# EAGLE design qtwo_schem (EAGLE 7.6.0)
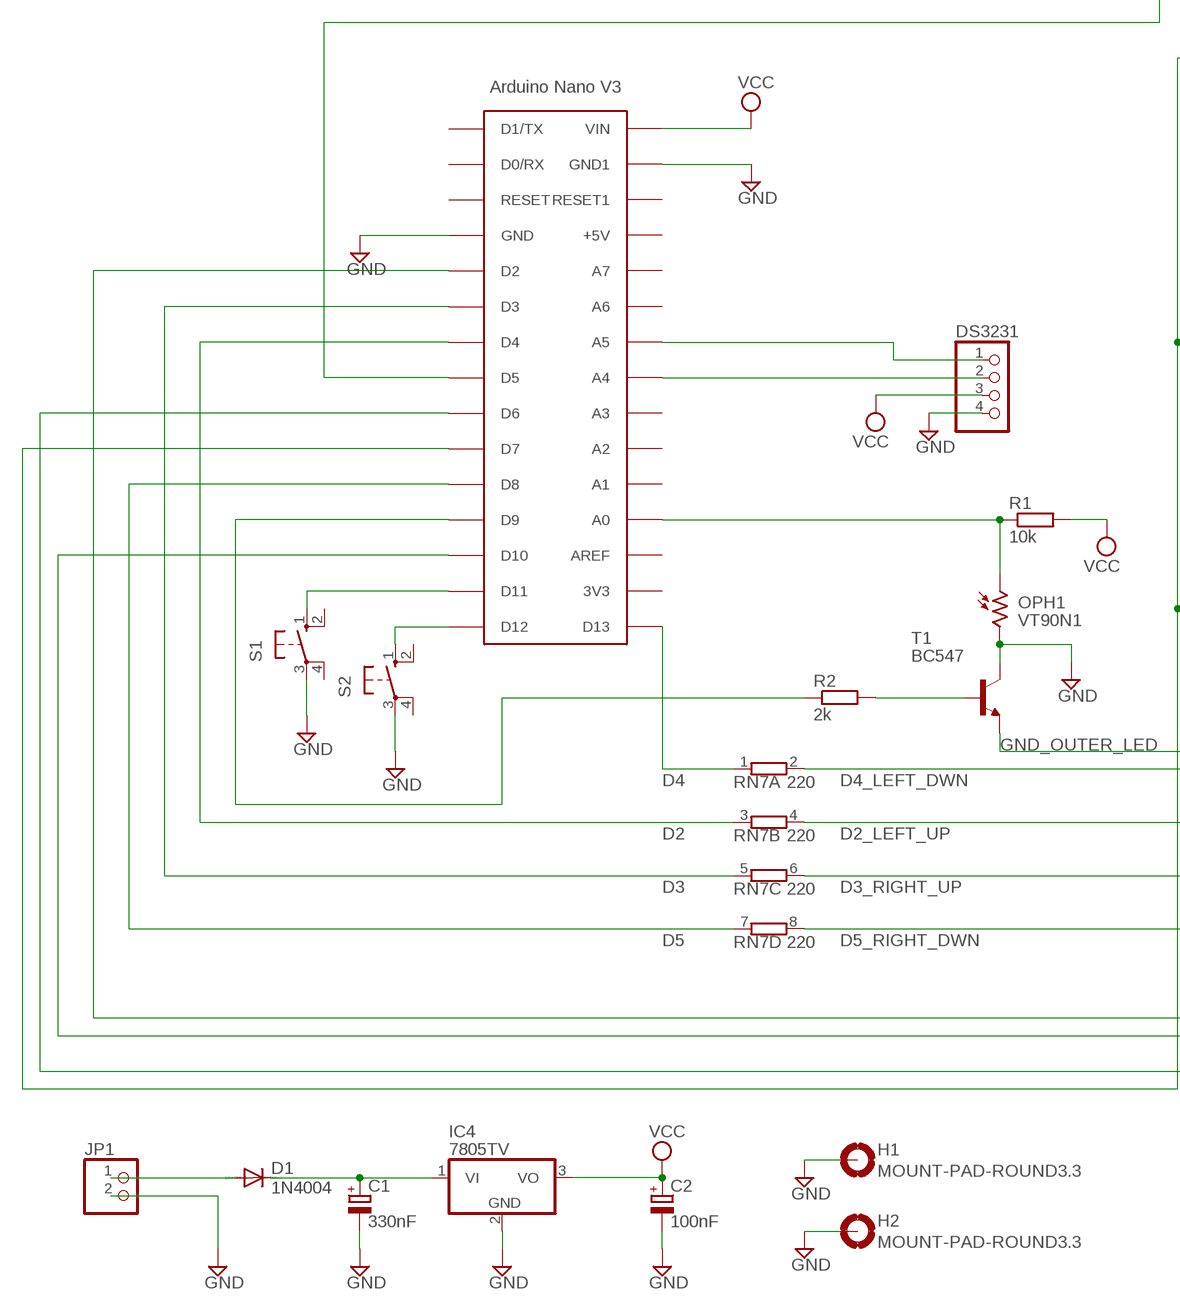
[diagram p0: schematic, sheet 1, part 1 of 2]
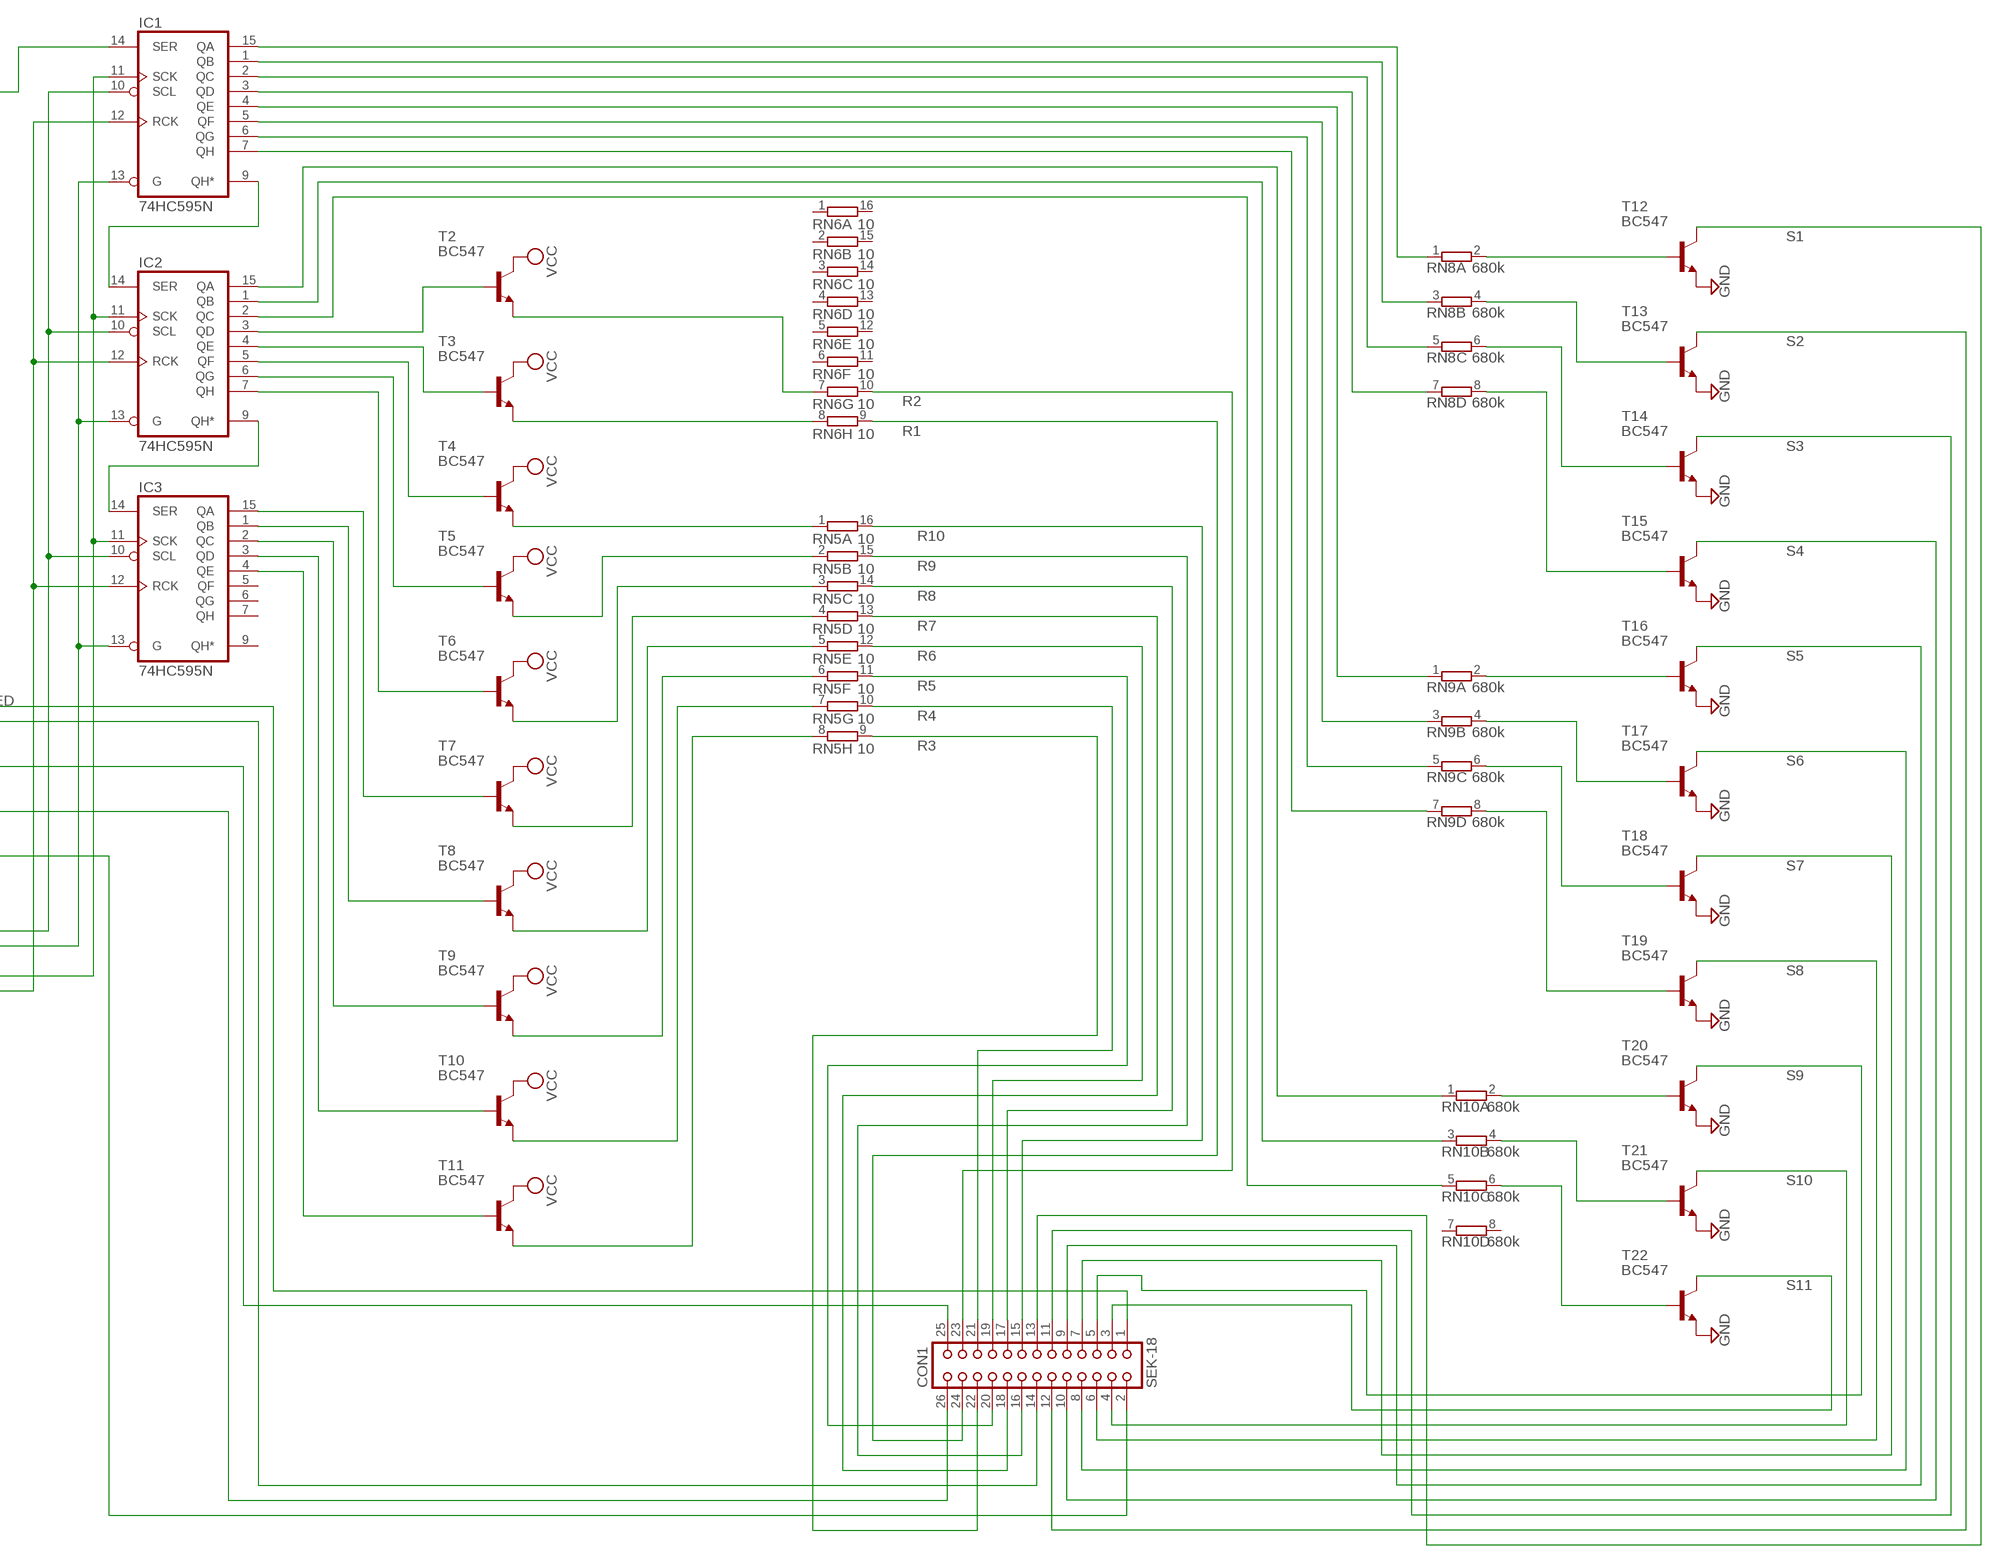
[diagram p1: schematic, sheet 1, part 2 of 2]

## Parts
C1  330nF  CPOL-EUE2,5-6E  [E2,5-6E]
C2  100nF  CPOL-EUE2,5-6E  [E2,5-6E]
CON1  SEK-18  CON26  [CON26]
D1  1N4004  [DO41-10]
DS3231  PINHD-1X4  [1X04]
H1  MOUNT-PAD-ROUND3.3  [3,3-PAD]
H2  MOUNT-PAD-ROUND3.3  [3,3-PAD]
IC1  74HC595N  [DIL16]
IC2  74HC595N  [DIL16]
IC3  74HC595N  [DIL16]
IC4  7805TV  [TO220V]
JP1  PINHD-1X2  [1X02]
OPH1  VT90N1  [VT900]
R1  10k  R-EU_0204/7  [0204/7]
R2  2k  R-EU_0204/7  [0204/7]
RN5  10  8R-N  [DIL16]
RN6  10  8R-N  [DIL16]
RN7  220  E4R  [SIL8]
RN8  680k  E4R  [SIL8]
RN9  680k  E4R  [SIL8]
RN10  680k  E4R  [SIL8]
S1  10-XX  [B3F-10XX]
S2  10-XX  [B3F-10XX]
T1  BC547  [TO92]
T2  BC547  [TO92]
T3  BC547  [TO92]
T4  BC547  [TO92]
T5  BC547  [TO92]
T6  BC547  [TO92]
T7  BC547  [TO92]
T8  BC547  [TO92]
T9  BC547  [TO92]
T10  BC547  [TO92]
T11  BC547  [TO92]
T12  BC547  [TO92]
T13  BC547  [TO92]
T14  BC547  [TO92]
T15  BC547  [TO92]
T16  BC547  [TO92]
T17  BC547  [TO92]
T18  BC547  [TO92]
T19  BC547  [TO92]
T20  BC547  [TO92]
T21  BC547  [TO92]
T22  BC547  [TO92]
U$1  ARDUINONANO  [PDIP-32]

## Nets
D2: RN7.3 U$1.D4
D2_LEFT_UP: CON1.25 RN7.4
D3: RN7.5 U$1.D3
D3_RIGHT_UP: CON1.26 RN7.6
D4: RN7.1 U$1.D13
D4_LEFT_DWN: CON1.14 RN7.2
D5: RN7.7 U$1.D8
D5_RIGHT_DWN: CON1.2 RN7.8
GND: C1.- C2.- DS3231.4 H1.B3,3(MOUNT) H2.B3,3(MOUNT) IC4.2(GND) JP1.2 OPH1.2 S1.3(P) S2.3(P) T1.3(C) T12.1(E) T13.1(E) T14.1(E) T15.1(E) T16.1(E) T17.1(E) T18.1(E) T19.1(E) T20.1(E) T21.1(E) T22.1(E) U$1.GND U$1.GND1
GND_OUTER_LED: CON1.1 T1.1(E)
N$1: C1.+ D1.C IC4.1(VI)
N$2: D1.A JP1.1
N$3: DS3231.2 U$1.A3(A4)
N$4: DS3231.1 U$1.A2(A5)
N$5: OPH1.1 R1.1 U$1.A7(A0)
N$6: S1.1(S) U$1.D11
N$7: S2.1(S) U$1.D12
N$8: IC1.10(SCL) IC2.10(SCL) IC3.10(SCL) U$1.D2
N$9: R2.1 U$1.D9
N$10: R2.2 T1.2(B)
N$11: IC1.13(G) IC2.13(G) IC3.13(G) U$1.D10
N$12: IC1.11(SCK) IC2.11(SCK) IC3.11(SCK) U$1.D6
N$13: IC1.12(RCK) IC2.12(RCK) IC3.12(RCK) U$1.D7
N$14: IC1.14(SER) U$1.D5
N$15: IC1.9(QH*) IC2.14(SER)
N$16: IC2.9(QH*) IC3.14(SER)
N$17: IC2.3(QD) T2.2(B)
N$18: IC2.4(QE) T3.2(B)
N$19: IC2.5(QF) T4.2(B)
N$20: IC2.6(QG) T5.2(B)
N$21: IC2.7(QH) T6.2(B)
N$22: IC3.15(QA) T7.2(B)
N$23: IC3.1(QB) T8.2(B)
N$24: IC3.2(QC) T9.2(B)
N$25: IC3.3(QD) T10.2(B)
N$26: IC3.4(QE) T11.2(B)
N$27: RN8.2 T12.2(B)
N$28: RN8.4 T13.2(B)
N$29: RN8.6 T14.2(B)
N$30: RN8.8 T15.2(B)
N$31: RN9.2 T16.2(B)
N$32: RN9.4 T17.2(B)
N$33: RN9.6 T18.2(B)
N$34: RN9.8 T19.2(B)
N$35: RN10.2 T20.2(B)
N$36: RN10.4 T21.2(B)
N$37: RN10.6 T22.2(B)
N$38: IC1.15(QA) RN8.1
N$39: IC1.1(QB) RN8.3
N$40: IC1.2(QC) RN8.5
N$41: IC1.3(QD) RN8.7
N$42: IC1.4(QE) RN9.1
N$43: IC1.5(QF) RN9.3
N$44: IC1.6(QG) RN9.5
N$45: IC1.7(QH) RN9.7
N$46: IC2.15(QA) RN10.1
N$47: IC2.1(QB) RN10.3
N$48: IC2.2(QC) RN10.5
N$49: RN6.7 T2.1(E)
N$50: RN6.8 T3.1(E)
N$51: RN5.1 T4.1(E)
N$52: RN5.2 T5.1(E)
N$53: RN5.3 T6.1(E)
N$54: RN5.4 T7.1(E)
N$55: RN5.5 T8.1(E)
N$56: RN5.6 T9.1(E)
N$57: RN5.7 T10.1(E)
N$58: RN5.8 T11.1(E)
R1: CON1.24 RN6.9
R2: CON1.23 RN6.10
R3: CON1.22 RN5.9
R4: CON1.21 RN5.10
R5: CON1.20 RN5.11
R6: CON1.19 RN5.12
R7: CON1.18 RN5.13
R8: CON1.17 RN5.14
R9: CON1.16 RN5.15
R10: CON1.15 RN5.16
S1: CON1.13 T12.3(C)
S2: CON1.12 T13.3(C)
S3: CON1.11 T14.3(C)
S4: CON1.10 T15.3(C)
S5: CON1.9 T16.3(C)
S6: CON1.8 T17.3(C)
S7: CON1.7 T18.3(C)
S8: CON1.6 T19.3(C)
S9: CON1.5 T20.3(C)
S10: CON1.4 T21.3(C)
S11: CON1.3 T22.3(C)
VCC: C2.+ DS3231.3 IC4.3(VO) R1.2 T2.3(C) T3.3(C) T4.3(C) T5.3(C) T6.3(C) T7.3(C) T8.3(C) T9.3(C) T10.3(C) T11.3(C) U$1.VIN
Unconnected: IC3.5(QF) IC3.6(QG) IC3.7(QH) IC3.9(QH*) RN6.1 RN6.2 RN6.3 RN6.4 RN6.5 RN6.6 RN6.11 RN6.12 RN6.13 RN6.14 RN6.15 RN6.16 RN10.7 RN10.8 S1.2(S1) S1.4(P1) S2.2(S1) S2.4(P1) U$1.3V3 U$1.+5V U$1.A0(A7) U$1.A1(A6) U$1.A4(A3) U$1.A5(A2) U$1.A6(A1) U$1.AREF U$1.D0/RX U$1.D1/TX U$1.RESET U$1.RESET1

## Power pins joined to a net without a drawn wire
GND: IC1.8(GND) IC2.8(GND) IC3.8(GND)
VCC: IC1.16(VCC) IC2.16(VCC) IC3.16(VCC)

## Library data of the parts
C1 C2 = rcl:CPOL-EU: POLARIZED CAPACITOR, European symbol
CON1 = con-harting:CON26: CONNECTOR; OC_FARNELL: unknown; OC_NEWARK: unknown
D1 = diode:1N4004: DIODE general purpose rectifier, 1 A
DS3231 = pinhead:PINHD-1X4: PIN HEADER
H1 H2 = holes:MOUNT-PAD-ROUND: MOUNTING PAD, round
IC1-IC3 = 74xx-eu:74*595: 8-bit SHIFT REGISTER, output latch
IC4 = linear:78*: Positive VOLTAGE REGULATOR Source: http://cache.national.com/ds/LM/LM78L05.pdf http://www.fairchildsemi.com/ds/LM/LM7805.pdf
JP1 = pinhead:PINHD-1X2: PIN HEADER
OPH1 = photo-elements:VT9: Photoconductive Cell VT900 Series Source: http://optoelectronics.perkinelmer.com/content/Datasheets/DTS_vt900seriesdatasheet.pdf
R1 R2 = rcl:R-EU_: RESISTOR, European symbol
RN5 RN6 = resistor-dil:8R-N: DIL RESISTOR; OC_FARNELL: unknown; OC_NEWARK: unknown
RN7-RN10 = resistor-sil:E4R: SIL RESISTOR; OC_FARNELL: unknown; OC_NEWARK: unknown
S1 S2 = switch-omron:10-XX: OMRON SWITCH; MPN: B3F-1000; OC_FARNELL: 176432; OC_NEWARK: 36M3542
T1-T22 = transistor:BC547: NPN TRANSISTOR
U$1 = CRE-Lib1:ARDUINONANO: Arduino Nano

## Board
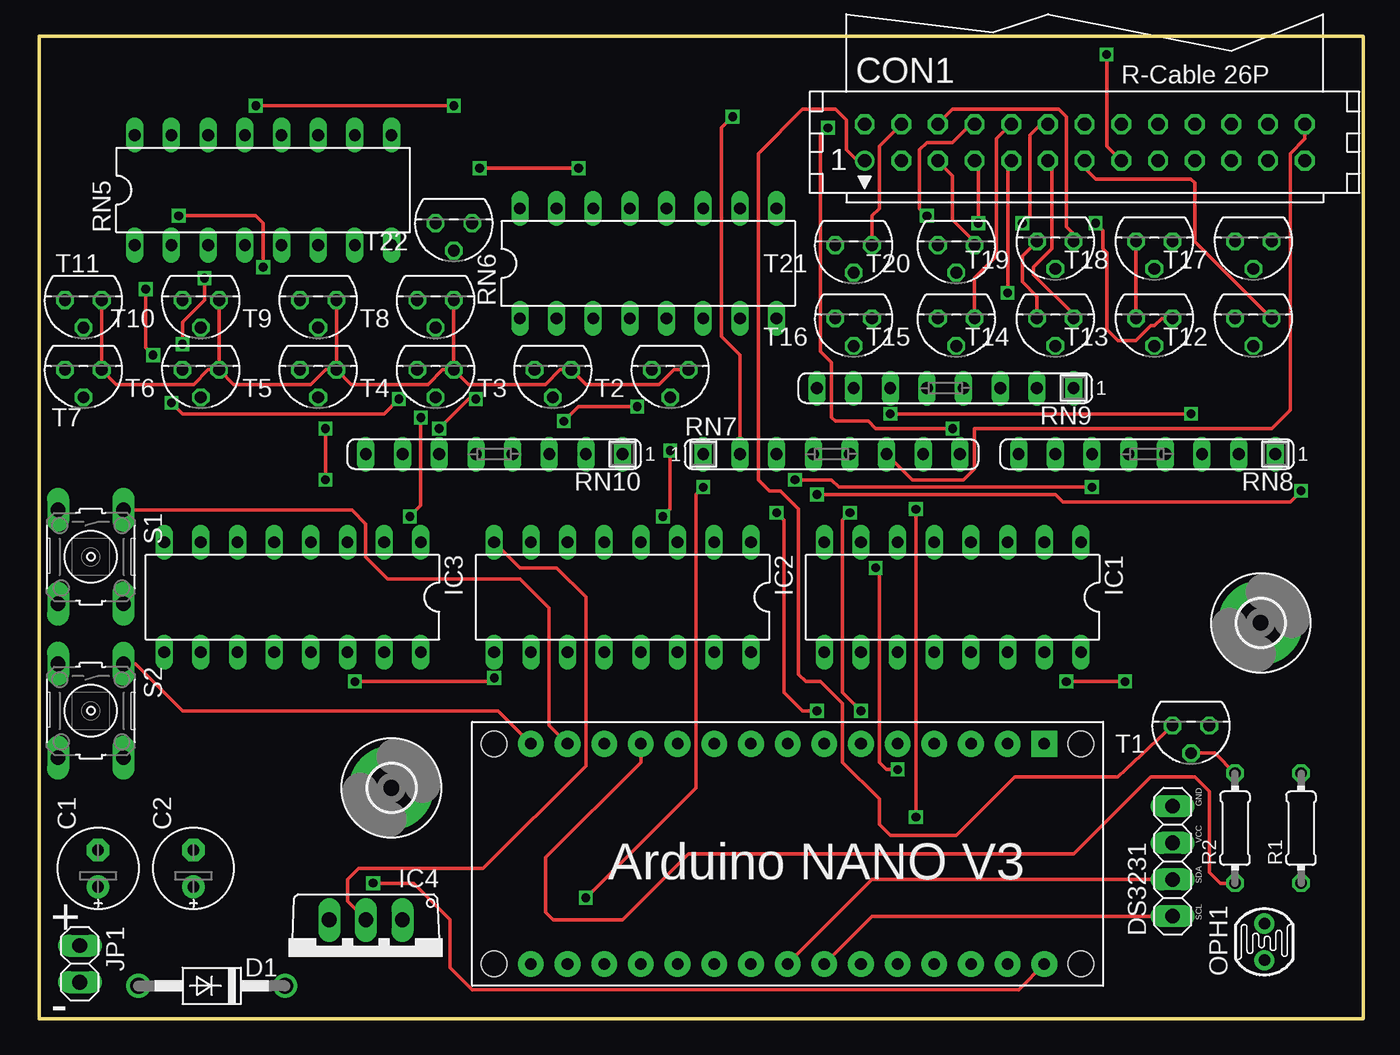
[diagram p2: board, top side]
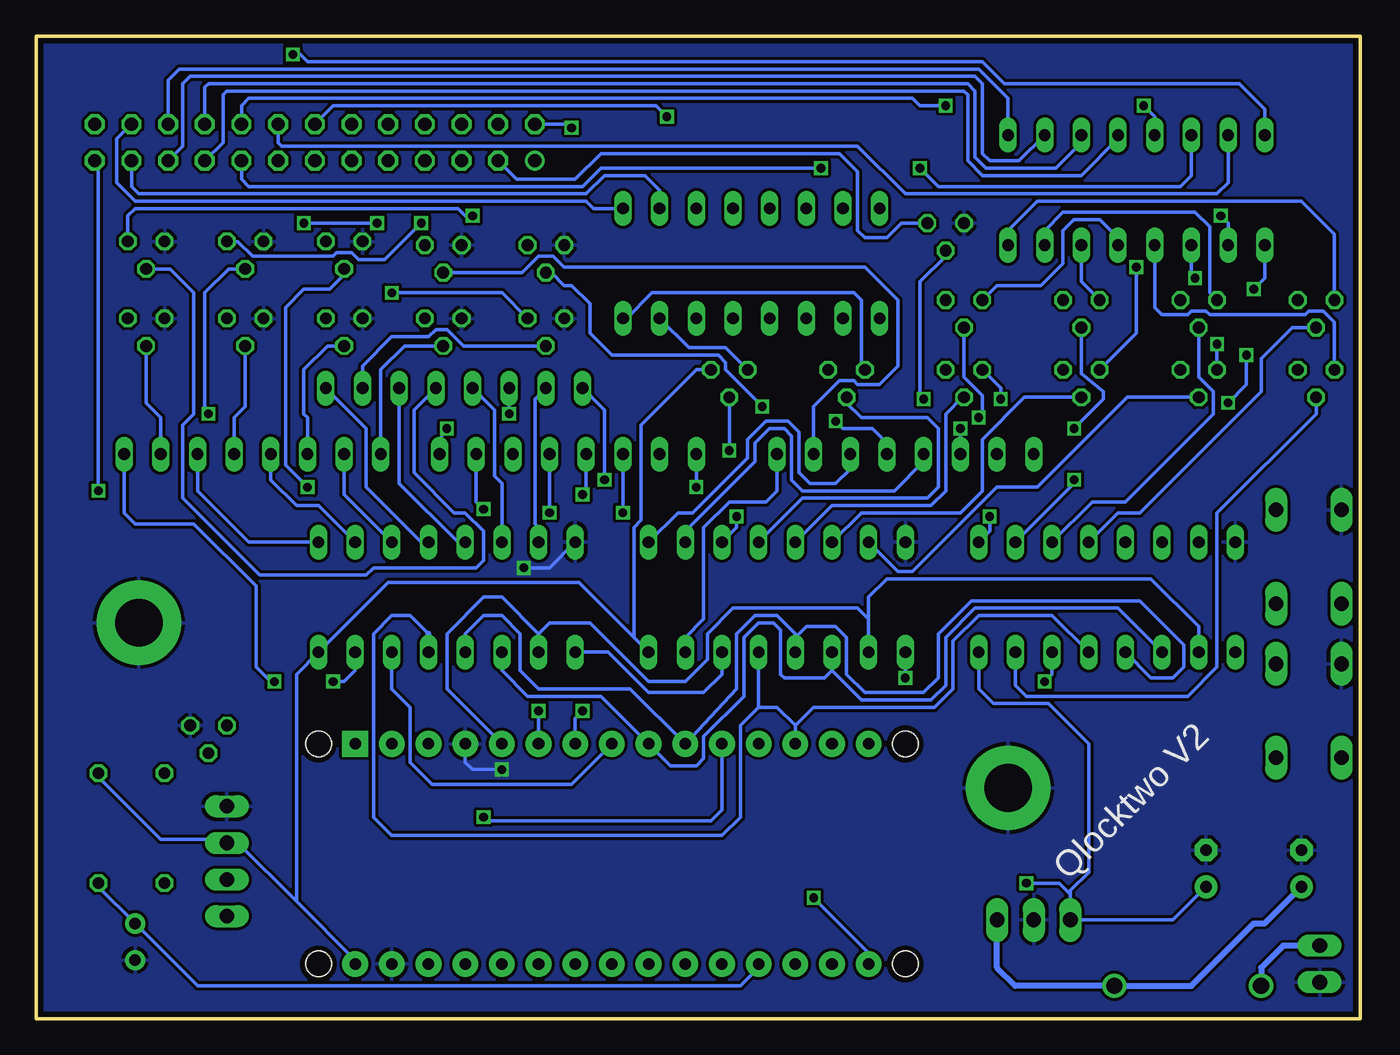
[diagram p3: board, bottom side, seen from below]

Size 91.69 x 68.07 mm. Coordinates in mm from the lower left corner, seen from the top.
Outline: 0,0 91.69,0 91.69,68.07 0,68.07 0,0
Copper layers (1*16): Top 0.0356mm / dielectric 1.5011mm / Bottom 0.0356mm
Design rules "oshpark-2layer": minimum track width 8mil, minimum drill 13mil, track to track 8mil, track to pad 8mil, pad to pad 8mil, via to via 8mil, smd to smd 8mil, copper to edge 15mil, drill to drill 8mil, minimum pad ring 7mil, minimum via ring 7mil, stop-mask expansion 2.5mil, vias tented up to drill 0mil, thermal gap 10mil

### Footprints (pad centres in the part's own frame; a part is rotated, then mirrored left to right if it is on the bottom)
E2,5-6E = drill 0.813 pad 1.575: + -1.27,0 | drill 0.813 pad 1.575 octagon: - 1.27,0
CON26 = drill 0.914: 1 -15.24,-1.27 | drill 0.914 octagon: 2 -15.24,1.27; 3 -12.7,-1.27; 4 -12.7,1.27; 5 -10.16,-1.27; 6 -10.16,1.27; 7 -7.62,-1.27; 8 -7.62,1.27; 9 -5.08,-1.27; 10 -5.08,1.27; 11 -2.54,-1.27; 12 -2.54,1.27; 13 0,-1.27; 14 0,1.27; 15 2.54,-1.27; 16 2.54,1.27; 17 5.08,-1.27; 18 5.08,1.27; 19 7.62,-1.27; 20 7.62,1.27; 21 10.16,-1.27; 22 10.16,1.27; 23 12.7,-1.27; 24 12.7,1.27; 25 15.24,-1.27; 26 15.24,1.27
DO41-10 = drill 1.118: A 5.08,0; C -5.08,0
1X04 = drill 1.016 long: 1 -3.81,0; 2 -1.27,0; 3 1.27,0; 4 3.81,0
3,3-PAD = drill 3.3 pad 5.842: B3,3 0,0
DIL16 = drill 0.813 long: 1 -8.89,-3.81; 2 -6.35,-3.81; 3 -3.81,-3.81; 4 -1.27,-3.81; 5 1.27,-3.81; 6 3.81,-3.81; 7 6.35,-3.81; 8 8.89,-3.81; 9 8.89,3.81; 10 6.35,3.81; 11 3.81,3.81; 12 1.27,3.81; 13 -1.27,3.81; 14 -3.81,3.81; 15 -6.35,3.81; 16 -8.89,3.81
TO220V = drill 1.016 long: 1 -2.54,-2.54; 2 0,-2.54; 3 2.54,-2.54
1X02 = drill 1.016 long: 1 -1.27,0; 2 1.27,0
VT900 = drill 0.8 pad 1.4: 1 -1.27,0; 2 1.27,0
0204/7 = drill 0.813 octagon: 1 -3.81,0; 2 3.81,0
SIL8 = drill 0.813 long: 1 -8.89,0; 2 -6.35,0; 3 -3.81,0; 4 -1.27,0; 5 1.27,0; 6 3.81,0; 7 6.35,0; 8 8.89,0
B3F-10XX = drill 1.016 long: 1 -3.251,2.261; 2 3.251,2.261; 3 -3.251,-2.261; 4 3.251,-2.261
TO92 = drill 0.813 octagon: 1 1.27,0; 2 0,1.905; 3 -1.27,0
PDIP-32 = drill 0.8 pad 1.778: 3V3 15.24,-35.56; +5V 15.24,-10.16; A0 15.24,-12.7; A1 15.24,-15.24; A2 15.24,-17.78; A3 15.24,-20.32; A4 15.24,-22.86; A5 15.24,-25.4; A6 15.24,-27.94; A7 15.24,-30.48; AREF 15.24,-33.02; D0/RX 0,-5.08; D2 0,-12.7; D3 0,-15.24; D4 0,-17.78; D5 0,-20.32; D6 0,-22.86; D7 0,-25.4; D8 0,-27.94; D9 0,-30.48; D10 0,-33.02; D11 0,-35.56; D12 0,-38.1; D13 15.24,-38.1; GND 0,-10.16; GND1 15.24,-5.08; RESET 0,-7.62; RESET1 15.24,-7.62; VIN 15.24,-2.54 | drill 0.8 pad 1.778 square: D1/TX 0,-2.54 | hole 1.778: 0,0; 0,-40.64; 15.24,-40.64; 15.24,0

### Placement (x,y rotation side)
C1  4.06,10.41 90 top
C2  10.67,10.41 90 top
CON1  72.39,60.71 0 top
D1  11.94,2.29 180 top
DS3231  78.49,10.92 90 top
H1  84.58,27.43 0 top
H2  24.38,16 0 top
IC1  63.25,29.21 180 top
IC2  40.39,29.21 180 top
IC3  17.53,29.21 180 top
IC4  22.61,4.32 180 top
JP1  2.79,3.81 270 top
OPH1  84.84,5.33 270 top
R1  87.38,13.21 90 top
R2  82.8,13.21 90 top
RN5  15.49,57.4 0 top
RN6  42.16,52.32 0 top
RN7  54.86,39.12 0 top
RN8  76.71,39.12 180 top
RN9  62.74,43.69 180 top
RN10  31.5,39.12 180 top
S1  3.56,32 270 top
S2  3.56,21.34 270 top
T1  79.76,20.32 180 top
T2  43.69,44.96 180 top
T3  35.56,44.96 180 top
T4  27.43,44.96 180 top
T5  19.3,44.96 180 top
T6  11.18,44.96 180 top
T7  3.05,44.96 180 top
T8  27.43,49.78 180 top
T9  19.3,49.78 180 top
T10  11.18,49.78 180 top
T11  3.05,49.78 180 top
T12  84.07,48.51 180 top
T13  77.22,48.51 180 top
T14  70.36,48.51 180 top
T15  63.5,48.51 180 top
T16  56.39,48.51 180 top
T17  84.07,53.85 180 top
T18  77.22,53.85 180 top
T19  70.36,53.85 180 top
T20  63.5,53.59 180 top
T21  56.39,53.59 180 top
T22  28.7,55.12 180 top
U$1  72.14,19.05 270 top

### Tracks (layer width: path | path; a pad name or v marks a point on that pad's centre or on a via)
D2  (via drill 0.6)
  Top 0.254: v51.05,35.05 51.56,34.54 51.56,22.61 52.83,21.34 v53.85,21.34
  Bottom 0.254: RN7.3 v51.05,35.05 | v53.85,21.34 54.36,20.83 U$1.D4
D2_LEFT_UP  (via drill 0.6)
  Top 0.254: v53.85,36.32 70.36,36.32 70.87,35.81 86.61,35.81 v87.38,36.58
  Bottom 0.254: RN7.4 53.59,36.58 v53.85,36.32 | v87.38,36.58 87.38,59.18 CON1.25
D3  (via drill 0.6)
  Top 0.254: v56.13,35.05 55.63,34.54 55.63,22.61 v56.9,21.34
  Bottom 0.254: RN7.5 v56.13,35.05 | v56.9,21.34 U$1.D3
D3_RIGHT_UP
  Top 0.254: CON1.26 87.63,60.96 86.61,59.94 86.61,42.16 85.34,40.89 64.77,40.89 64.77,38.1 64.01,37.34 60.45,37.34 RN7.6
D4  (via drill 0.6)
  Top 0.254: v45.97,36.83 45.47,36.32 45.47,16 v37.85,8.38
  Bottom 0.254: RN7.1 v45.97,36.83 | v37.85,8.38 34.04,4.57 U$1.D13
D4_LEFT_DWN  (via drill 0.6)
  Top 0.254: RN7.2 48.51,45.97 47.24,47.24 47.24,61.72 v48.01,62.48
  Bottom 0.254: v48.01,62.48 48.77,63.25 71.12,63.25 CON1.14
D5  (via drill 0.6)
  Top 0.254: v60.71,13.97 v60.71,35.31
  Bottom 0.254: U$1.D8 44.2,14.48 44.96,13.72 60.45,13.72 v60.71,13.97 | v60.71,35.31 61.21,35.81 RN7.7
D5_RIGHT_DWN  (via drill 0.6)
  Top 0.254: v54.61,61.72 54.1,61.21 54.1,46.23 54.86,45.47 54.86,41.66 55.12,41.4 57.4,41.4 57.91,40.89 v63.25,40.89
  Bottom 0.254: CON1.2 54.86,61.98 v54.61,61.72 | v63.25,40.89 63.75,40.13 RN7.8
GND  (via drill 0.6)
  Top 0.254: v57.91,31.24 58.17,30.99 58.17,17.78 58.67,17.27 v59.44,17.27 | T14.1 69.09,50.04 68.07,51.05 68.07,52.83 T19.1 | T13.1 T18.1 | IC2.8 33.27,31.24 35.81,31.24 37.85,29.21 37.85,17.53 30.73,10.41 22.1,10.41 21.34,9.65 21.34,8.13 IC4.2
  Bottom 0.254: IC1.8 56.13,31.24 v57.91,31.24 | v59.44,17.27 61.47,17.27 61.98,17.78 U$1.GND
  pour Bottom: 0.51,67.56 91.19,67.56 91.19,0.51 0.51,0.51
GND_OUTER_LED
  Top 0.254: CON1.1 56.64,59.44 55.88,60.2 55.88,62.23 55.12,62.99 52.83,62.99 49.78,59.94 49.78,37.34 50.55,36.58 51.31,36.58 52.58,35.31 52.58,23.88 53.09,23.37 54.1,23.37 55.63,21.84 55.63,17.78 58.17,15.24 58.17,13.46 58.93,12.7 63.5,12.7 67.56,16.76 74.68,16.76 T1.1
N$1
  Bottom 0.406: IC4.1 25.15,3.56 23.88,2.29 D1.C 11.68,2.29 7.37,6.6 6.6,6.6 C1.+
N$2
  Bottom 0.406: JP1.1 5.33,5.08 6.86,3.56 D1.A
N$3
  Top 0.254: DS3231.2 57.66,9.65 U$1.A3
N$4
  Top 0.254: DS3231.1 57.66,7.11 U$1.A2
N$5
  Bottom 0.254: R1.1 87.38,9.14 OPH1.1 80.52,2.29 42.93,2.29 41.66,3.56 U$1.A7
N$6
  Top 0.254: S1.1 21.64,35.25 22.61,34.29 22.61,32 24.13,30.48 33.27,30.48 35.31,28.45 35.31,20.32 U$1.D11
N$7
  Top 0.254: S2.1 6.66,24.59 9.91,21.34 31.75,21.34 U$1.D12
N$8
  Bottom 0.254: 56.9,26.67 59.44,29.21 60.71,29.21 63.25,26.67 63.25,22.86 U$1.D2 | IC2.10 34.04,27.69 | 34.04,27.69 34.04,29.21 32.77,30.48 14.48,30.48 11.18,27.18 IC3.10 | IC1.10 56.9,26.67 | 56.9,26.67 56.13,27.43 53.34,27.43 49.28,23.37 46.74,23.37 45.21,24.89 45.21,26.67 43.43,28.45 34.8,28.45 34.04,27.69
N$9
  Top 0.254: R2.1 81.79,9.4 81.03,10.16 81.03,15.75 80.01,16.76 76.96,16.76 71.63,11.43 44.96,11.43 40.39,6.86 35.56,6.86 35.05,7.37 35.05,11.18 41.66,17.78 U$1.D9
N$10
  Top 0.254: T1.2 81.41,18.41 R2.2
N$11
  Bottom 0.254: 64.52,26.67 65.79,27.94 67.06,27.94 68.33,26.67 68.33,13.97 67.06,12.7 44.2,12.7 42.93,13.97 42.93,20.32 41.66,21.59 | 41.66,21.59 40.39,21.59 39.12,20.32 | 39.12,20.32 U$1.D10 | IC2.13 41.66,21.59 | 39.12,20.32 37.85,21.59 29.46,21.59 28.19,22.86 28.19,26.16 26.42,27.94 21.34,27.94 IC3.13
  Bottom 0.406: IC1.13 64.52,26.67
N$12
  Bottom 0.254: IC1.11 59.44,24.13 57.66,22.35 52.58,22.35 U$1.D6 47.75,17.53 45.97,17.53 45.47,18.03 45.47,19.56 42.67,22.35 42.67,26.42 41.66,27.43 40.64,27.43 40.13,26.92 40.13,23.88 39.88,23.62 37.08,23.62 36.58,24.13 | IC2.11 36.58,24.13 | 36.58,24.13 34.54,22.1 29.72,22.1 28.7,23.11 28.7,26.42 26.67,28.45 16.76,28.45 IC3.11
N$13
  Bottom 0.254: IC1.12 61.98,26.67 60.71,27.94 59.44,27.94 58.17,26.67 58.17,24.13 56.9,22.86 50.55,22.86 U$1.D7 43.18,22.86 43.18,26.67 41.91,27.94 40.39,27.94 39.12,26.67 39.12,26.42 | IC2.12 39.12,26.42 | IC3.12 14.48,23.62 12.95,23.62 12.19,24.38 12.19,25.91 15.24,28.96 26.92,28.96 29.21,26.67 29.21,23.62 30.23,22.61 34.29,22.61 35.56,23.88 35.56,26.42 36.32,27.18 38.35,27.18 39.12,26.42
N$14
  Bottom 0.254: IC1.14 67.06,22.86 65.79,21.59 65.79,17.78 64.26,16.26 54.61,16.26 U$1.D5
N$15
  Bottom 0.254: IC1.9 52.07,25.4 49.28,22.61 45.47,22.61 44.2,23.88 IC2.14
N$16  (via drill 0.6)
  Top 0.254: v31.5,23.62 31.24,23.37 v21.84,23.37
  Bottom 0.254: IC2.9 v31.5,23.62 | v21.84,23.37 21.34,23.88 IC3.14
N$17  (via drill 0.6)
  Top 0.254: v43.69,39.37 43.69,35.31 v43.18,34.8
  Bottom 0.254: T2.2 v43.69,39.37 | v43.18,34.8 43.18,34.04 IC2.3
N$18
  Bottom 0.254: T3.2 35.56,42.67 34.54,41.66 29.97,41.66 29.21,40.89 29.21,36.83 29.97,36.07 38.61,36.07 IC2.4
N$19
  Bottom 0.254: IC2.5 36.58,35.56 29.72,35.56 28.7,36.58 28.7,41.91 27.56,43.05 T4.2
N$20
  Bottom 0.254: T5.2 23.24,43.05 26.16,40.13 26.16,36.58 27.69,35.05 34.54,35.05 IC2.6
N$21
  Bottom 0.254: T6.2 16.13,43.05 22.35,36.83 25.15,36.83 30.99,30.99 32,30.99 IC2.7
N$22
  Bottom 0.254: T7.2 3.05,41.91 9.91,35.05 9.91,24.38 11.94,22.35 23.11,22.35 23.88,23.11 IC3.15
N$23  (via drill 0.6)
  Top 0.254: v26.42,41.66 26.42,35.56 v25.65,34.8
  Bottom 0.254: T8.2 27.43,44.45 26.16,43.18 26.16,41.91 v26.42,41.66 | v25.65,34.8 25.65,33.78 IC3.1
N$24  (via drill 0.6)
  Top 0.254: v19.81,40.89 v19.81,37.34
  Bottom 0.254: T9.2 19.3,44.7 17.78,43.43 17.78,42.93 v19.81,40.89 | v19.81,37.34 19.81,37.08 IC3.2
N$25
  Bottom 0.254: T10.2 11.18,44.45 10.16,43.43 10.16,41.91 16.26,35.81 18.54,35.81 IC3.3
N$26
  Bottom 0.254: T11.2 4.7,47.88 6.86,45.72 6.86,43.43 15.24,35.05 16.76,35.05 IC3.4
N$27
  Bottom 0.254: T12.2 84.07,42.67 83.06,41.66 RN8.2
N$28
  Bottom 0.254: T13.2 77.22,42.42 77.98,41.66 RN8.4
N$29
  Bottom 0.254: T14.2 71.5,46.61 73.15,44.96 73.15,41.91 72.9,41.66 RN8.6
N$30
  Bottom 0.254: T15.2 66.17,46.61 67.82,44.96 RN8.8
N$31
  Bottom 0.254: T16.2 62.1,46.61 63.25,47.75 64.01,47.75 64.52,47.24 67.06,47.24 69.09,45.21 RN9.2
N$32
  Bottom 0.254: T17.2 82.42,51.94 80.77,50.29 80.77,41.91 81.53,41.15 81.53,36.07 76.2,30.73 68.83,30.73 68.33,31.24 61.21,31.24 60.71,31.75 60.71,33.78 61.98,35.05 62.74,35.05 65.53,37.85 65.53,42.16 RN9.4
N$33  (via drill 0.6)
  Top 0.254: v79.76,41.91 v58.93,41.91
  Bottom 0.254: T18.2 78.36,51.94 80.01,50.29 80.01,42.16 v79.76,41.91 | v58.93,41.91 RN9.6
N$34  (via drill 0.6)
  Top 0.254: v72.9,36.83 55.37,36.83 54.86,37.34 v52.32,37.34
  Bottom 0.254: T19.2 70.36,51.56 71.37,50.55 73.15,50.55 74.42,49.28 74.42,38.35 v72.9,36.83 | v52.32,37.34 52.32,42.16 RN9.8
N$35
  Bottom 0.254: RN10.2 37.85,42.42 36.07,44.2 35.05,44.2 34.8,43.94 33.27,43.94 32,45.21 32,49.78 34.29,52.07 55.12,52.07 55.88,52.83 56.9,52.83 58.04,51.69 T20.2
N$36  (via drill 0.6)
  Top 0.254: v41.4,42.42 37.34,42.42 v36.32,41.4
  Bottom 0.254: T21.2 56.01,51.69 55.12,50.8 54.61,50.8 53.34,49.53 53.34,47.5 51.82,45.97 44.45,45.97 43.94,45.47 43.94,44.96 v41.4,42.42 | v36.32,41.4 35.81,40.89 33.78,40.89 32.77,39.88 RN10.4
N$37  (via drill 0.6)
  Top 0.254: v30.23,42.93 29.72,42.93 v27.69,40.89
  Bottom 0.254: T22.2 28.7,52.83 30.48,51.05 30.48,43.18 v30.23,42.93 | v27.69,40.89 RN10.6
N$38  (via drill 0.6)
  Top 0.254: v75.18,23.37 v71.12,23.37
  Bottom 0.254: RN8.1 85.6,35.05 84.84,34.29 80.77,34.29 76.45,29.97 76.45,24.38 75.44,23.37 v75.18,23.37 | v71.12,23.37 70.36,23.37 69.6,24.13 IC1.15
N$39
  Bottom 0.254: RN8.3 80.52,36.58 76.96,33.02 IC1.1
N$40
  Bottom 0.254: RN8.5 75.44,37.34 73.66,35.56 72.14,35.56 IC1.2
N$41
  Bottom 0.254: RN8.7 70.36,36.32 IC1.3
N$42
  Bottom 0.254: IC1.4 65.02,33.02 68.83,36.83 68.83,40.89 RN9.1
N$43
  Bottom 0.254: IC1.5 62.48,33.02 66.55,37.08 RN9.3
N$44
  Bottom 0.254: IC1.6 59.44,37.08 59.94,37.59 59.94,42.16 RN9.5
N$45
  Bottom 0.254: IC1.7 56.9,34.04 57.15,34.29 57.15,42.93 RN9.7
N$46
  Bottom 0.254: RN10.1 40.39,36.58 41.15,35.81 43.69,35.81 45.47,34.04 45.47,27.69 46.74,26.42 IC2.15
N$47
  Bottom 0.254: RN10.3 35.31,38.1 36.32,37.08 38.1,37.08 38.86,37.85 38.86,40.64 39.62,41.4 41.15,41.4 42.42,40.13 42.42,38.86 46.23,35.05 47.24,35.05 IC2.1
N$48
  Bottom 0.254: RN10.5 30.23,38.61 32.26,36.58 38.61,36.58 39.37,37.34 39.37,40.39 39.88,40.89 40.89,40.89 41.91,39.88 41.91,38.61 46.74,33.78 IC2.2
N$49
  Bottom 0.254: RN6.7 46.48,46.48 43.94,46.48 T2.1
N$50
  Bottom 0.254: RN6.8 50.8,48.51 49.02,50.29 35.05,50.29 34.54,49.78 34.54,45.21 T3.1
N$51  (via drill 0.6)
  Top 0.254: v7.37,50.55 7.37,46.48 v7.87,45.97 | v9.14,42.67 9.91,41.91 23.88,41.91 v24.89,42.93
  Bottom 0.254: RN5.1 6.6,51.31 v7.37,50.55 | v7.87,45.97 7.87,43.94 v9.14,42.67 | v24.89,42.93 24.89,43.69 T4.1
N$52  (via drill 0.6)
  Top 0.254: v9.65,55.63 14.99,55.63 15.49,55.12 v15.49,52.07
  Bottom 0.254: RN5.2 9.14,55.12 v9.65,55.63 | v15.49,52.07 15.49,47.5 T5.1
N$53  (via drill 0.6)
  Top 0.254: v11.43,51.31 11.43,49.78 9.91,48.26 v9.91,46.74
  Bottom 0.254: RN5.3 11.68,51.56 v11.43,51.31 | v9.91,46.74 T6.1
N$54
  Bottom 0.254: RN5.4 14.22,49.28 13.72,48.77 11.94,48.77 11.68,49.02 10.67,49.02 10.41,48.77 3.81,48.77 3.56,49.02 2.54,49.02 1.78,48.26 T7.1
N$55
  Bottom 0.254: RN5.5 16.76,54.1 18.03,55.37 19.81,55.37 20.57,54.61 20.57,52.32 22.1,50.8 25.15,50.8 T8.1
N$56
  Bottom 0.254: RN5.6 19.3,51.05 T9.1
N$57
  Bottom 0.254: RN5.7 21.84,54.61 20.57,55.88 11.43,55.88 10.41,54.86 10.41,50.29 T10.1
N$58
  Bottom 0.254: RN5.8 24.38,54.61 22.35,56.64 4.06,56.64 1.78,54.36 T11.1
R1
  Bottom 0.254: RN6.9 53.09,56.13 53.59,56.64 84.84,56.64 86.11,57.91 86.11,60.96 CON1.24
R2
  Bottom 0.254: RN6.10 48.51,57.4 49.53,58.42 52.32,58.42 53.59,57.15 84.58,57.15 85.09,57.66 CON1.23
R3
  Bottom 0.254: CON1.22 82.55,65.02 81.79,65.79 26.42,65.79 24.38,63.75 RN5.9
R4
  Bottom 0.254: RN5.10 23.62,59.44 25.65,59.44 26.16,59.94 26.16,64.77 26.67,65.28 81.03,65.28 81.53,64.77 81.53,60.45 CON1.21
R5
  Bottom 0.254: RN5.11 19.3,60.71 21.08,58.93 25.91,58.93 26.67,59.69 26.67,64.26 27.18,64.77 79.76,64.77 80.01,64.52 CON1.20
R6
  Bottom 0.254: RN5.12 16.76,60.96 19.3,58.42 26.16,58.42 27.18,59.44 27.18,64.01 27.43,64.26 78.49,64.26 78.74,64.01 78.74,60.71 CON1.19
R7  (via drill 0.6)
  Top 0.254: v14.99,63.25 v28.7,63.25
  Bottom 0.254: RN5.13 14.22,62.48 v14.99,63.25 | v28.7,63.25 30.48,63.25 30.99,63.75 76.96,63.75 77.47,63.25 CON1.18
R8  (via drill 0.6)
  Top 0.254: v30.48,58.93 v37.34,58.93
  Bottom 0.254: RN5.14 11.68,58.42 12.45,57.66 29.21,57.66 v30.48,58.93 | v37.34,58.93 52.58,58.93 53.85,57.66 76.96,57.66 77.47,58.17 CON1.17
R9
  Bottom 0.254: RN5.15 9.14,57.91 9.91,57.15 31.5,57.15 34.8,60.45 74.68,60.45 74.93,60.71 CON1.16
R10  (via drill 0.6)
  Top 0.254: v73.91,66.8 73.91,60.45 CON1.15
  Bottom 0.254: RN5.16 6.6,62.99 8.38,64.77 24.64,64.77 26.16,66.29 72.9,66.29 73.41,66.8 v73.91,66.8
S1
  Top 0.254: CON1.13 72.39,58.93 73.15,58.17 79.76,58.17 80.01,57.91 80.01,53.85 T12.3
S2  (via drill 0.6)
  Top 0.254: CON1.12 69.34,61.98 68.58,61.21 68.58,55.63 v68.07,55.12 | v73.15,55.12 73.66,54.61 73.66,53.34 73.91,53.09 73.91,47.75 74.68,46.99 75.95,46.99 76.96,48.01 77.22,48.01 77.72,48.51 T13.3
  Bottom 0.254: v68.07,55.12 v73.15,55.12
S3
  Top 0.254: T14.3 71.63,48.77 68.83,51.56 68.83,52.07 70.1,53.34 70.1,59.18 CON1.11
S4
  Top 0.254: T15.3 64.77,51.31 66.29,52.83 66.29,60.96 CON1.10
S5  (via drill 0.6)
  Top 0.254: v67.06,50.29 67.06,59.18 CON1.9
  Bottom 0.254: v67.06,50.29 59.44,50.29 T16.3
S6  (via drill 0.6)
  Top 0.254: CON1.8 64.52,61.98 63.25,60.71 61.47,60.71 60.96,60.2 60.96,56.13 v61.47,55.63
  Bottom 0.254: v61.47,55.63 61.98,55.63 62.48,56.13 84.84,56.13 85.34,55.63 T17.3
S7  (via drill 0.6)
  Top 0.254: v65.02,55.12 65.02,59.18 CON1.7
  Bottom 0.254: T18.3 77.72,53.85 76.71,52.83 71.12,52.83 70.87,53.09 69.85,53.09 69.34,52.58 67.56,52.58 v65.02,55.12
S8
  Top 0.254: T19.3 71.63,54.36 71.12,54.86 71.12,62.48 70.61,62.99 63.25,62.99 CON1.6
S9
  Top 0.254: T20.3 64.77,53.85 63.25,55.37 63.25,58.42 CON1.5
S10
  Top 0.254: T21.3 57.66,55.63 58.17,56.13 58.17,60.45 CON1.4
S11
  Bottom 0.254: T22.3 31.75,55.12 32.77,54.1 34.29,54.1 34.8,54.61 34.8,58.67 36.07,59.94 52.58,59.94 54.36,58.17 58.42,58.17 CON1.3
VCC  (via drill 0.6)
  Top 0.254: T4.3 29.72,43.94 35.05,43.94 36.07,44.96 T3.3 37.85,43.94 42.93,43.94 43.94,44.96 T2.3 | T5.3 21.59,43.94 26.92,43.94 27.94,44.96 T4.3 | T6.3 13.46,43.94 18.8,43.94 19.81,44.96 T5.3 | T6.3 11.68,44.96 10.67,43.94 5.33,43.94 T7.3 T11.3 | T8.3 T4.3 | T6.3 T10.3 | T5.3 T9.3 | v23.11,9.4 25.91,9.4 28.45,6.86 28.45,3.56 29.97,2.03 67.82,2.03 U$1.VIN
  Bottom 0.254: 20.07,8.64 IC4.3 12.95,6.86 C2.+ | 20.07,8.64 20.07,8.89 18.8,10.16 18.8,19.05 21.59,21.84 25.4,21.84 26.42,22.86 IC3.16 | 50.29,26.42 54.1,30.23 67.31,30.23 IC1.16 73.66,23.88 73.66,8.13 | 50.29,26.42 IC2.16 | T2.3 45.97,44.96 49.78,41.15 49.78,34.54 50.29,34.04 50.29,26.42 | 73.66,8.13 77.72,12.19 DS3231.3 78.74,12.45 83.06,12.45 87.38,16.76 R1.2 | v23.11,9.4 20.83,9.4 20.07,8.64 | U$1.VIN 69.6,4.06 73.66,8.13

### Text on the board
tPlace: GND | VCC | SDA | SCL | + | -
tNames: Arduino NANO V3
bNames: Qlocktwo V2